# EAGLE design SparkFun_Transparent_Graphical_OLED_Breakout (EAGLE 9.1.3)
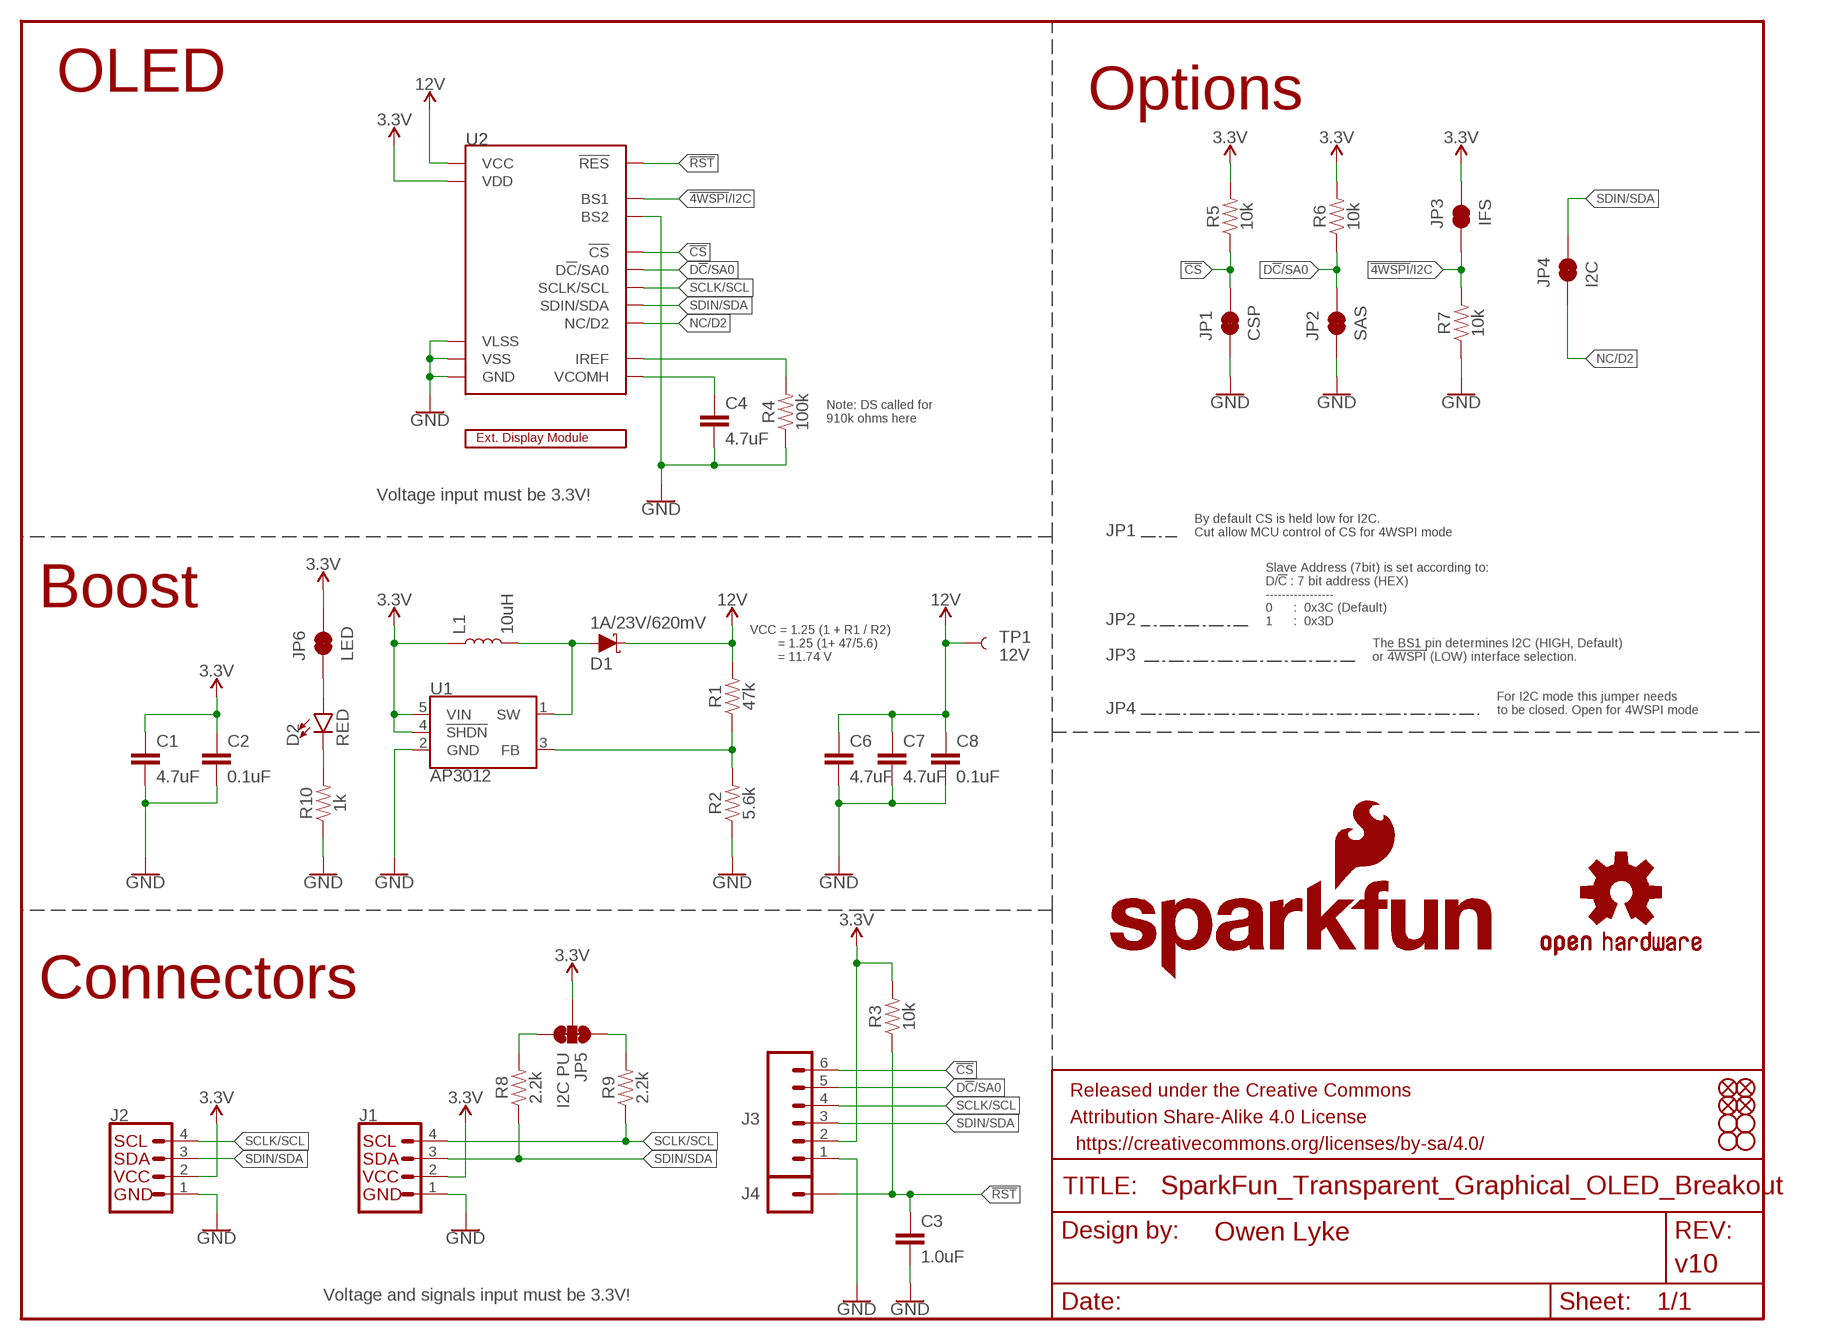
[diagram p0: schematic, sheet 1]

## Parts
C1  4.7uF  4.7UF-0603-35V-(20%)  [0603]
C2  0.1uF  0.1UF-0603-100V-10%  [0603]
C3  1.0uF  1.0UF-0603-16V-10%-X7R  [0603]
C4  4.7uF  4.7UF-0603-35V-(20%)  [0603]
C6  4.7uF  4.7UF-0603-35V-(20%)  [0603]
C7  4.7uF  4.7UF-0603-35V-(20%)  [0603]
C8  0.1uF  0.1UF-0603-100V-10%  [0603]
D1  1A/23V/620mV  DIODE-SCHOTTKY-BAT20J  [SOD-323]
D2  RED  LED-RED0603  [LED-0603]
FD1  FIDUCIAL1X2  [FIDUCIAL-1X2]
FD2  FIDUCIAL1X2  [FIDUCIAL-1X2]
FD3  FIDUCIAL1X2  [FIDUCIAL-1X2]
FD4  FIDUCIAL1X2  [FIDUCIAL-1X2]
FRAME1  FRAME-LETTER  [CREATIVE_COMMONS]
H1  STAND-OFF  [STAND-OFF]
H2  STAND-OFF  [STAND-OFF]
H3  STAND-OFF  [STAND-OFF]
H4  STAND-OFF  [STAND-OFF]
J1  QWIIC_CONNECTORJS-1MM  [JST04_1MM_RA]
J2  QWIIC_CONNECTORJS-1MM  [JST04_1MM_RA]
J3  CONN_06NO_SILK_NO_POP  [1X06_NO_SILK]
J4  CONN_01PTH_NO_SILK_YES_STOP  [1X01_NO_SILK]
JP1  CSP  JUMPER-SMT_2_NC_TRACE_SILK  [SMT-JUMPER_2_NC_TRACE_SILK]
JP2  SAS  JUMPER-SMT_2_NC_TRACE_SILK  [SMT-JUMPER_2_NC_TRACE_SILK]
JP3  IFS  JUMPER-SMT_2_NC_TRACE_SILK  [SMT-JUMPER_2_NC_TRACE_SILK]
JP4  I2C  JUMPER-SMT_2_NC_TRACE_SILK  [SMT-JUMPER_2_NC_TRACE_SILK]
JP5  I2C PU  JUMPER-SMT_3_2-NC_TRACE_SILK  [SMT-JUMPER_3_2-NC_TRACE_SILK]
JP6  LED  JUMPER-SMT_2_NC_TRACE_SILK  [SMT-JUMPER_2_NC_TRACE_SILK]
L1  10uH  INDUCTOR-CDRH-10UH  [INDUCTOR_4.7UH]
LOGO1  SFE_LOGO_NAME_FLAME.1_INCH  [SFE_LOGO_NAME_FLAME_.1]
LOGO2  OSHW-LOGOS  [OSHW-LOGO-S]
R1  47k  47KOHM-0603-1/10W-1%  [0603]
R2  5.6k  5.6KOHM-0603-1/10W-1%  [0603]
R3  10k  10KOHM-0603-1/10W-1%  [0603]
R4  100k  100KOHM-0603-1/10W-1%  [0603]
R5  10k  10KOHM-0603-1/10W-1%  [0603]
R6  10k  10KOHM-0603-1/10W-1%  [0603]
R7  10k  10KOHM-0603-1/10W-1%  [0603]
R8  2.2k  2.2KOHM-0603-1/10W-1%  [0603]
R9  2.2k  2.2KOHM-0603-1/10W-1%  [0603]
R10  1k  1KOHM-0603-1/10W-1%  [0603]
TP1  12V  TEST-POINT3  [PAD.03X.03]
U1  AP3012  [SOT23-5]
U2  UG-2856KLBAG01_4WSPI  [FPC05024-42201]
U$26  EXTERNAL_DISP-UG-2856KLBAG01  [EXT_DISP]

## Nets
3.3V: C1.1 C2.1 J1.2 J2.2 J3.2 JP3.1 JP5.2 JP6.2 L1.P$1 R3.2 R5.2 R6.2 U1.4(!SHDN!) U1.5(VIN) U2.P$5(VDD)
12V: C6.1 C7.1 C8.1 D1.C R1.2 TP1.P$1 U2.P$23(VCC)
!4WSPI!/I2C: JP3.2 R7.2 U2.P$6(BS1)
!CS: J3.6 JP1.2 R5.1 U2.P$8(!CS)
!RST: C3.1 J4.1 R3.1 U2.P$9(!RES)
D!C!/SA0: J3.5 JP2.2 R6.1 U2.P$10(D!C!/SA0)
GND: C1.2 C2.2 C3.2 C4.2 C6.2 C7.2 C8.2 J1.1 J2.1 J3.1 JP1.1 JP2.1 R2.1 R4.1 R7.1 R10.1 U1.2(GND) U2.P$1(GND) U2.P$2(VLSS) U2.P$3(VSS) U2.P$7(BS2) U2.P$11(GND) U2.P$12(GND) U2.P$16(GND) U2.P$17(GND) U2.P$18(GND) U2.P$19(GND) U2.P$20(GND) U2.P$24(GND)
N$1: R4.2 U2.P$21(IREF)
N$2: D2.C R10.2
N$3: C4.1 U2.P$22(VCOMH)
N$4: D1.A L1.P$2 U1.1(SW)
N$5: R1.1 R2.2 U1.3(FB)
N$6: JP5.3 R8.2
N$7: JP5.1 R9.2
N$8: D2.A JP6.1
NC/D2: JP4.1 U2.P$15(NC/D2)
SCLK/SCL: J1.4 J2.4 J3.4 R9.1 U2.P$13(SCLK/SCL)
SDIN/SDA: J1.3 J2.3 J3.3 JP4.2 R8.1 U2.P$14(SDIN/SDA)

## Notes on the sheet
- OLED | Options
- Note: DS called for
  910k ohms here
- Voltage input must be 3.3V!
- JP1
- By default CS is held low for I2C. 
  Cut allow MCU control of CS for 4WSPI mode
- Boost
- JP2
- Slave Address (7bit) is set according to:
  D/!C! : 7 bit address (HEX)
  -----------------
  0      :  0x3C (Default)
  1      :  0x3D
- VCC = 1.25 (1 + R1 / R2)
          = 1.25 (1+ 47/5.6)
          = 11.74 V
- JP3
- The BS1 pin determines I2C (HIGH, Default) 
  or !4WSPI! (LOW) interface selection.
- JP4
- For I2C mode this jumper needs 
  to be closed. Open for 4WSPI mode
- Connectors
- Voltage and signals input must be 3.3V!

## Library data of the parts
C1 C4 C6 C7 = SparkFun-Capacitors:4.7UF: 4.7µF ceramic capacitors A capacitor is a passive two-terminal electrical component used to store electrical energy temporarily in an electric field.; PROD_ID: CAP-14106
C2 C8 = SparkFun-Capacitors:0.1UF: 0.1µF ceramic capacitors A capacitor is a passive two-terminal electrical component used to store electrical energy temporarily in an electric field.; PROD_ID: CAP-08390
C3 = SparkFun-Capacitors:1.0UF: 1µF ceramic capacitors A capacitor is a passive two-terminal electrical component used to store electrical energy temporarily in an electric field.; PROD_ID: CAP-13930
D1 = SparkFun-DiscreteSemi:DIODE-SCHOTTKY: Schottky diode A Schottky diode is a semiconductor diode which has a low forward voltage drop and a very fast switching action.; PROD_ID: DIO-11623
D2 = SparkFun-LED:LED-RED: Red SMD LED Used in manufacturing of most products at SparkFun Packages: 0603 - SMD 0603 package [Product Link] <http://docs.avagotech.com/docs/AV02-0551EN> 0603 SMART - SMD 0603 SMART package ( more efficient and expensive)[Product Link] <http://www.osram-os.com/Graphics/XPic2/00077099_0.pdf> 1206 - SMD1206 package [Product Link] <https://www.sparkfun.com/datasheets/DevTools/LilyPad/Q150OVS4.pdff> SparkFun Products: Pro Mini 328 -5V <https://www.sparkfun.com/products/821> RedBoard <https://www.sparkfun.com/products/12757> IOIO-OTG <https://www.sparkfun.com/products/13613>; PROD_ID: DIO-00819
FD1-FD4 = SparkFun-Aesthetics:FIDUCIAL: Fiducial Alignment Points Point-of-reference for pick-and-place machines and other optical instruments.
FRAME1 = SparkFun-Aesthetics:FRAME-LETTER: Schematic Frame - Letter Standard 8.5x11 US Letter frame; DESIGNER: Owen Lyke; REV: v10
H1-H4 = SparkFun-Hardware:STAND-OFF: Stand Off Drill holes for mechanically mounting via screws, standoffs, etc. Note: Use the keepout ring to avoid running the screw head into surrounding components. Variant Overviews STAND-OFF - Mechanical footprint for a #4 phillips button head screw. STAND-OFF-TIGHT - Mechanical footprint for a #4 phillips button head screw, Example SparkFun Products Screw - Phillips Head (1/4", 4-40, 10 pack) <https://www.sparkfun.com/products/10453> (PRT-10453) Screw - Phillips Head (1/2", 4-40, 10 pack) <https://www.sparkfun.com/products/10452> (PRT-10452) Screw - Phillips Head (3/4", 4-40, 10 pack) <https://www.sparkfun.com/products/10451> (PRT-10451) Screw - Phillips Head (1", 4-40, 10 pack) <https://www.sparkfun.com/products/10450> (PRT-10450)
J1 J2 = SparkFun-Connectors:QWIIC_CONNECTOR: SparkFun I2C Standard Qwiic Connector An SMD 1mm pitch JST connector makes it easy and quick (get it? Qwiic?) to connect I2C devices to each other. The Qwiic system <http://www.sparkfun.com/qwiic> enables fast and solderless connection between popular platforms and various sensors and actuators. We carry 200mm <https://www.sparkfun.com/products/14204>, 100mm <https://www.sparkfun.com/products/14205>, 50mm <https://www.sparkfun.com/products/14206>, and breadboard friendly <https://www.sparkfun.com/products/14207> Qwiic cables. We also offer 10 pcs strips <https://www.sparkfun.com/products/14323> the SMD connectors.; PROD_ID: CONN-13694
J3 = SparkFun-Connectors:CONN_06: Multi connection point. Often used as Generic Header-pin footprint for 0.1 inch spaced/style header connections On any of the 0.1 inch spaced packages, you can populate with these: Break Away Headers - Straight <https://www.sparkfun.com/products/116> (PRT-00116) Break Away Male Headers - Right Angle <https://www.sparkfun.com/products/553> (PRT-00553) Female Headers <https://www.sparkfun.com/products/115> (PRT-00115) Break Away Headers - Machine Pin <https://www.sparkfun.com/products/117> (PRT-00117) Break Away Female Headers - Swiss Machine Pin <https://www.sparkfun.com/products/743> (PRT-00743) Arduino Stackable Header - 6 Pin <https://www.sparkfun.com/products/9280> (PRT-09280) For SCREWTERMINALS and SPRING TERMINALS visit here: Screw Terimnals on SparkFun.com <https://www.sparkfun.com/search/results?term=Screw+Terminals> (5mm/3.5mm/2.54mm spacing) This device is also useful as a general connection point to wire up your design to another part of your project. Our various solder wires solder well into these plated through hole pads. Hook-Up Wire - Assortment (Stranded, 22 AWG) <https://www.sparkfun.com/products/11375> (PRT-11375) Hook-Up Wire - Assortment (Solid Core, 22 AWG) <https://www.sparkfun.com/products/11367> (PRT-11367) View the entire wire category on our website here <https://www.sparkfun.com/categories/141>
J4 = SparkFun-Connectors:CONN_01: Single connection point. Often used as Generic Header-pin footprint for 0.1 inch spaced/style header connections On any of the 0.1 inch spaced packages, you can populate with these: Break Away Headers - Straight <https://www.sparkfun.com/products/116> (PRT-00116) Break Away Male Headers - Right Angle <https://www.sparkfun.com/products/553> (PRT-00553) Female Headers <https://www.sparkfun.com/products/115> (PRT-00115) Break Away Headers - Machine Pin <https://www.sparkfun.com/products/117> (PRT-00117) Break Away Female Headers - Swiss Machine Pin <https://www.sparkfun.com/products/743> (PRT-00743) This device is also useful as a general connection point to wire up your design to another part of your project. Our various solder wires solder well into these plated through hole pads. Hook-Up Wire - Assortment (Stranded, 22 AWG) <https://www.sparkfun.com/products/11375> (PRT-11375) Hook-Up Wire - Assortment (Solid Core, 22 AWG) <https://www.sparkfun.com/products/11367> (PRT-11367) View the entire wire category on our website here <https://www.sparkfun.com/categories/141> Special notes: SMTSO-256-ET is a "flush mount" nut for a 4-40 screw. We mostly use this on specialty testbeds; it is a nice way to connect hardware to your PCB at an adjustable hieght. Also note, the SNAP packages are for using a snappable style connector. We sell a baggie of snaps and they are also used on two LilyPad designs: Snap Assortment - 30 pack (male and female) <https://www.sparkfun.com/products/11347> (DEV-11347) LilyPad Arduino SimpleSnap <https://www.sparkfun.com/products/10941> (DEV-10941) LilyPad SimpleSnap Protoboard <https://www.sparkfun.com/products/10940> (DEV-10940)
JP1-JP4 JP6 = SparkFun-Jumpers:JUMPER-SMT_2_NC_TRACE: Normally closed trace jumper This jumper has a trace between two pads so it's normally closed (NC). Use a razor knife to open the connection. For best results follow the IPC guidelines for cutting traces: Cutout at least 0.063 mm (0.005 in). Remove all loose material to clean up the cut area. Seal the cut with an approved epoxy. Reapply solder to reclose the connection.
JP5 = SparkFun-Jumpers:JUMPER-SMT_3_2-NC_TRACE: Normally closed trace jumper (2 of 2 connections) This jumper has a trace between all three pads so they are normally closed (NC). Use a razor knife to open the connection(s). For best results follow the IPC guidelines for cutting traces: Cutout at least 0.063 mm (0.005 in). Remove all loose material to clean up the cut area. Seal the cut with an approved epoxy. Reapply solder to reclose the connection(s).
L1 = SparkFun-Coils:INDUCTOR: Inductors Resist changes in electrical current. Basically a coil of wire. SparkFun Products: SparkFun Load Cell Amplifier - HX711 <https://www.sparkfun.com/products/13879> IOIO-OTG - V2.2 <https://www.sparkfun.com/products/13613>; PROD_ID: NDUC-13968
LOGO1 = SparkFun-Aesthetics:SFE_LOGO_NAME_FLAME: SparkFun Font Logo w/ Flame This is the SparkFun full logo. The logo on the schematic will always be the same size; the package variant is the height of the flame part of the logo. Default layer for the logo on the board is tSilk.
LOGO2 = SparkFun-Aesthetics:OSHW-LOGO: Open-Source Hardware (OSHW) Logo This logo indicates the piece of hardware it is found on incorporates a OSHW license and/or adheres to the definition of open source hardware found here: http://freedomdefined.org/OSHW
R1 = SparkFun-Resistors:47KOHM: 47kΩ resistor A resistor is a passive two-terminal electrical component that implements electrical resistance as a circuit element. Resistors act to reduce current flow, and, at the same time, act to lower voltage levels within circuits. - Wikipedia; PROD_ID: RES-07871
R2 = SparkFun-Resistors:5.6KOHM: 5.6kΩ resistor A resistor is a passive two-terminal electrical component that implements electrical resistance as a circuit element. Resistors act to reduce current flow, and, at the same time, act to lower voltage levels within circuits. - Wikipedia; PROD_ID: RES-12378
R3 R5-R7 = SparkFun-Resistors:10KOHM: 10kΩ resistor A resistor is a passive two-terminal electrical component that implements electrical resistance as a circuit element. Resistors act to reduce current flow, and, at the same time, act to lower voltage levels within circuits. - Wikipedia; PROD_ID: RES-00824
R4 = SparkFun-Resistors:100KOHM: 100kΩ resistor A resistor is a passive two-terminal electrical component that implements electrical resistance as a circuit element. Resistors act to reduce current flow, and, at the same time, act to lower voltage levels within circuits. - Wikipedia; PROD_ID: RES-07828
R8 R9 = SparkFun-Resistors:2.2KOHM: 2.2kΩ resistor A resistor is a passive two-terminal electrical component that implements electrical resistance as a circuit element. Resistors act to reduce current flow, and, at the same time, act to lower voltage levels within circuits. - Wikipedia; PROD_ID: RES-08272
R10 = SparkFun-Resistors:1KOHM: 1kΩ resistor A resistor is a passive two-terminal electrical component that implements electrical resistance as a circuit element. Resistors act to reduce current flow, and, at the same time, act to lower voltage levels within circuits. - Wikipedia; PROD_ID: RES-07856
TP1 = SparkFun-Connectors:TEST-POINT: SparkFun Test Points Bare copper test points for troubleshooting or In-Circuit-Testing. These are used by our Production team for verifying production board runs using pogo-pins on test beds. SparkFun Products: SparkFun LSM9DS1 Breakout <https://www.sparkfun.com/products/13284> SparkFun PSOC <https://www.sparkfun.com/products/13714> SparkFun Load Cell Amplifier <https://www.sparkfun.com/products/13879>
U1 = SparkFun-IC-Power:AP3012: AP3012 The AP3012 is a high power, constant frequency, current mode PWM, inductor based, step-up (boost) converter. The converter operates at high frequency (1.5MHz) so that a small, low profile inductor can be used. Datasheet <https://www.diodes.com/assets/Datasheets/AP3012.pdf>; PROD_ID: VREG-13911
U2 = SparkFun-Displays:UG-2856KLBAG01_4WSPI; PROD_ID: CONN-14195
U$26 = SparkFun-Displays:EXTERNAL_DISP: External Display Device Use this device to represent a display module that you connect to your board with a connector. (The connector will be electrically linked to the symbol for your display and connected to traces) Using this along with a footprint of the display module outline will allow the BOM utility to find the correct PROD_ID for the module. Then you can move it to the BOM list (it will be in non-BOM list unless it has a hardware element like holes or pads) Variants: KWH018ST14-F01A footprint of the KWH018ST14-F01 with holes SparkFun Products:; PROD_ID: LCD-14194

## Board
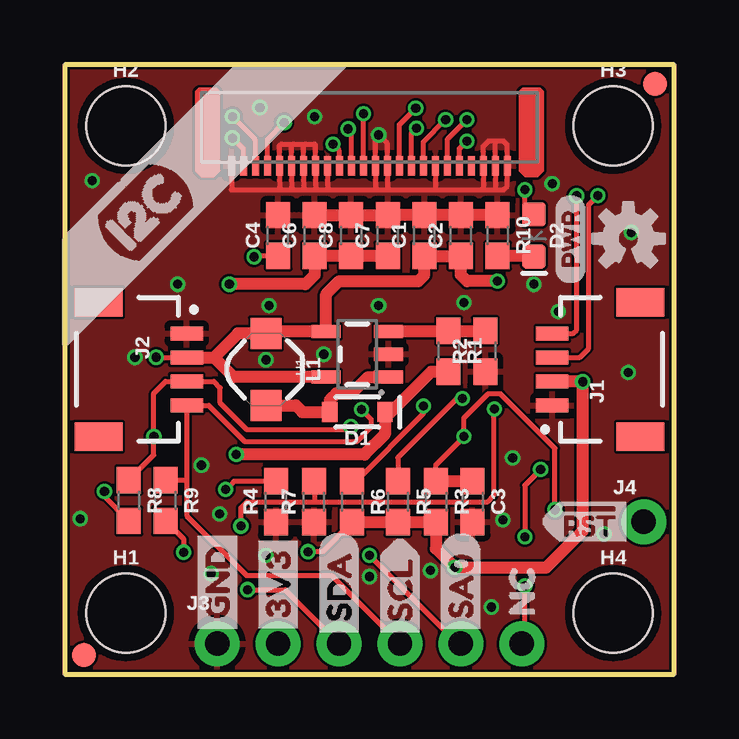
[diagram p1: board, top side]
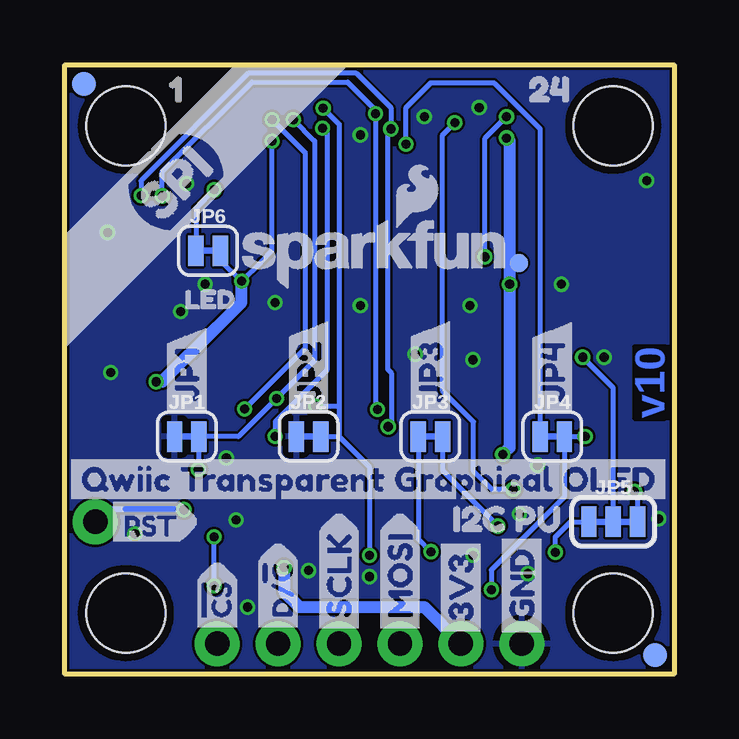
[diagram p2: board, bottom side, seen from below]

Size 25.4 x 25.4 mm. Coordinates in mm from the lower left corner, seen from the top.
Outline: 0,0 25.4,0 25.4,25.4 0,25.4 0,0
Copper layers (1*16): Top 0.035mm / dielectric 1.5mm / Bottom 0.035mm
Design rules "SparkFun-2-layer-FAB-LIMIT": minimum track width 4mil, minimum drill 6mil, track to track 4mil, track to pad 4mil, pad to pad 4mil, via to via 4mil, smd to smd 4mil, copper to edge 4mil, drill to drill 4mil, minimum pad ring 5mil, minimum via ring 5mil, stop-mask expansion 4mil, vias tented up to drill 25mil, thermal gap 10mil

### Footprints (pad centres in the part's own frame; a part is rotated, then mirrored left to right if it is on the bottom)
0603 = smd 1.1 x 1: 1 -0.85,0; 2 0.85,0
SOD-323 = smd 0.63 x 0.83: A 1.15,0; C -1.15,0
LED-0603 = smd 1 x 1: A -0.877,0; C 0.877,0
FIDUCIAL-1X2 = smd 1 x 1: 1 0,0
STAND-OFF = hole 3.302: 0,0
JST04_1MM_RA = smd 0.6 x 1.35: 1 -1.5,0; 2 -0.5,0; 3 0.5,0; 4 1.5,0 | smd 1.2 x 2: NC1 2.8,-3.675; NC2 -2.8,-3.675
1X06_NO_SILK = drill 1.016 pad 1.88: 1 0,0; 2 2.54,0; 3 5.08,0; 4 7.62,0; 5 10.16,0; 6 12.7,0
1X01_NO_SILK = drill 1.016 pad 1.88: 1 0,0
SMT-JUMPER_2_NC_TRACE_SILK = smd 0.635 x 1.27: 1 -0.508,0; 2 0.508,0
SMT-JUMPER_3_2-NC_TRACE_SILK = smd 0.635 x 1.27: 1 -1.016,0; 2 0,0; 3 1.016,0
INDUCTOR_4.7UH = smd 1.3 x 1.3: P$1 -1.5,0; P$2 1.5,0
PAD.03X.03 = smd 0.762 x 0.762: P$1 0,0
SOT23-5 = smd 0.55 x 1.2: 1 -0.95,-1.3; 2 0,-1.3; 3 0.95,-1.3; 4 0.95,1.3; 5 -0.95,1.3
FPC05024-42201 = smd 0.3 x 0.8: P$1 -5.75,0.4; P$2 -5.25,0.4; P$3 -4.75,0.4; P$4 -4.25,0.4; P$5 -3.75,0.4; P$6 -3.25,0.4; P$7 -2.75,0.4; P$8 -2.25,0.4; P$9 -1.75,0.4; P$10 -1.25,0.4; P$11 -0.75,0.4; P$12 -0.25,0.4; P$13 0.25,0.4; P$14 0.75,0.4; P$15 1.25,0.4; P$16 1.75,0.4; P$17 2.25,0.4; P$18 2.75,0.4; P$19 3.25,0.4; P$20 3.75,0.4; P$21 4.25,0.4; P$22 4.75,0.4; P$23 5.25,0.4; P$24 5.75,0.4

### Placement (x,y rotation side)
C1  14.99,18.29 90 top
C2  16.51,18.29 90 top
C3  16.99,7.19 270 top
C4  8.89,18.29 90 top
C6  10.41,18.29 90 top
C7  13.46,18.29 90 top
C8  11.94,18.29 90 top
D1  12.19,10.92 180 top
D2  19.56,18.29 270 top
FD1  0.79,0.79 0 top
FD2  0.79,0.79 0 bottom
FD3  24.61,24.61 0 top
FD4  24.61,24.61 0 bottom
FRAME1  -11.43,-10.16 0 top  (outside the outline)
H1  2.54,2.54 0 top
H2  2.54,22.86 0 top
H3  22.86,22.86 0 top
H4  22.86,2.54 0 top
J1  20.32,12.7 90 top
J2  5.08,12.7 270 top
J3  6.35,1.27 0 top
J4  24.13,6.35 0 top
JP1  20.32,9.91 0 bottom
JP2  15.24,9.91 0 bottom
JP3  10.16,9.91 0 bottom
JP4  5.08,9.91 0 bottom
JP5  2.54,6.35 0 bottom
JP6  19.43,17.65 0 bottom
L1  8.38,12.7 270 top
LOGO1  12.45,17.53 0 bottom
LOGO2  23.5,18.16 0 top
R1  16,13.46 270 top
R2  17.53,13.46 90 top
R3  15.47,7.19 270 top
R4  8.8,7.19 90 top
R5  13.88,7.19 270 top
R6  11.98,7.19 270 top
R7  10.39,7.19 90 top
R8  2.67,7.24 270 top
R9  4.19,7.24 270 top
R10  18.03,18.29 270 top
TP1  6.48,17.14 0 bottom
U1  12.19,13.34 90 top
U2  12.7,21.59 180 top
U$1  [JP10]  20.32,10.41 90 bottom
U$2  [QWIIC_TRANSPARENT_GRAPHICAL_OLED15]  25.65,8.13 0 bottom
U$3  [JP21]  15.24,10.41 90 bottom
U$4  [GND0]  6.35,1.4 90 top
U$5  [3V31]  8.89,1.4 90 top
U$6  [SCL0]  13.97,1.27 90 top
U$7  [SDA3]  11.43,1.27 90 top
U$8  [#CS7]  19.05,1.27 90 bottom
U$9  [NC10]  19.05,1.52 90 top
U$10  [MOSI9]  11.43,1.4 90 bottom
U$11  [JP32]  10.16,10.41 90 bottom
U$12  [SA08]  16.51,1.4 90 top
U$13  [3V31]  8.89,1.27 90 bottom
U$14  [GND0]  6.35,1.27 90 bottom
U$15  [D##C6]  16.51,1.27 90 bottom
U$16  [JP43]  5.08,10.41 90 bottom
U$17  [#RST1]  24.03,6.35 0 bottom
U$18  [LED4]  21.08,15.62 0 bottom
U$19  [I2C3]  1.14,17.14 45 top
U$20  [SCLK2]  13.97,1.4 90 bottom
U$21  [PWR5]  21.08,16.26 90 top
U$22  [17]  21.97,24.38 0 bottom
U$23  [248]  6.99,24.38 0 bottom
U$24  [SPI2]  22.86,18.41 45 bottom
U$25  [I2C_PU0]  10.16,6.48 0 bottom
U$26  -19.05,-15.24 0 top  (outside the outline)
U$28  [#RST0]  19.68,6.35 0 top

### Tracks (layer width: path | path; a pad name or v marks a point on that pad's centre or on a via)
3.3V  (via drill 0.38)
  Top 0.203: U2.P$5 16.45,21.91 v16.76,22.23 | R6.2 10.74,5.1 v10.14,5.1 | v3.81,13.21 v3.82,13.2 J2.2
  Top 0.508: J2.2 6.21,13.2 | 6.21,13.2 7.21,14.2 L1.P$1 8.47,14.29 U1.4 10.89,15.85 11.43,16.38 14.73,16.38 14.99,16.64 C1.1 C2.1 16.51,16.64 16.76,16.38 v18.03,16.38 | J1.2 v21.58,12.2 v21.59,12.19 21.59,5.97 20.83,5.21 20.07,4.45 v16.26,4.45 15.47,5.23 R3.2 R5.2 R6.2 | U1.5 7.03,12.38 6.21,13.2
  Bottom 0.203: v16.76,22.23 16.76,17.65 17.21,17.21 v18.03,16.38 18.92,17.27 JP6.2 | JP3.1 10.67,5.63 v10.14,5.1 | JP5.2 2.54,11.94 v3.81,13.21
  Bottom 0.508: v16.26,4.45 16.26,3.43 15.62,2.79 10.41,2.79 J3.2 | v18.03,16.38 18.03,15.49 19.05,14.48 21.34,12.19 v21.59,12.19
12V  (via drill 0.38)
  Top 0.203: U2.P$23 7.45,21.89 v6.99,22.35
  Top 0.508: C7.1 C8.1 C6.1 10.41,16.64 10.03,16.26 v6.86,16.26 | R1.2 15.28,12.61 13.59,10.92 D1.C 13.34,10 12.5,9.16 v7.14,9.16
  Bottom 0.203: TP1.P$1 6.86,17.14
  Bottom 0.508: v6.99,22.35 6.86,22.23 6.86,17.14 v6.86,16.26 6.86,9.44 v7.14,9.16
!4WSPI!/I2C  (via drill 0.38)
  Top 0.203: U2.P$6 15.95,22.3 v16.76,23.11 | v7.34,6.17 7.34,6.93 7.59,7.19 10.41,7.19 | 10.41,7.19 17.63,7.19 17.88,7.44 17.88,11.02 v17.91,11.05 | R7.2 10.41,8.01 10.41,7.19
  Bottom 0.203: v16.76,23.11 15.37,21.72 15.37,13.59 v17.91,11.05 | JP3.2 9.65,8.48 v7.34,6.17
!CS  (via drill 0.38)
  Top 0.203: U2.P$8 14.95,22.19 v15.88,23.11 | v19.84,8.53 19.18,7.87 v19.18,5.71 | J3.6 19.18,1.4 v19.18,3.68 | R5.1 13.88,9.03 16.34,11.49 v16.57,11.49
  Bottom 0.203: v15.88,23.11 14.99,22.23 14.99,13.08 v16.57,11.49 18.16,9.91 JP1.2 19.81,8.56 v19.84,8.53 | v19.18,3.68 v19.18,5.71
!RST  (via drill 0.38)
  Top 0.203: U2.P$9 14.45,22.55 v14.66,22.76 | v20.43,6.86 20.43,9.41 18.16,11.68 17.64,11.68 16.63,10.67 v16.63,9.91 16.63,9.88 15.47,8.72 R3.1
  Top 0.508: C3.1 R3.1
  Bottom 0.203: v14.66,22.76 14.48,22.58 14.48,12.68 16.63,10.52 v16.63,9.91
  Bottom 0.254: v20.43,6.86 23.62,6.86 J4.1
D!C!/SA0  (via drill 0.38)
  Top 0.203: U2.P$10 13.95,22.92 v14.63,23.6 | R6.1 12.13,8.04 14.95,10.86 v14.95,11.18 | v12.7,4.95 16.38,1.27 J3.5
  Bottom 0.203: v14.63,23.6 13.97,22.94 13.97,11.18 | 13.97,11.18 13.97,9.91 | v14.95,11.18 13.97,11.18 | JP2.2 13.97,9.91 | 13.97,9.91 12.7,8.64 v12.7,4.95
GND  (via drill 0.38)
  Top 0.203: U2.P$24 6.95,20.19 8.89,20.19 | 8.89,20.19 9.53,20.19 | 9.53,20.19 9.91,20.19 | 9.91,20.19 10.41,20.19 | 10.41,20.19 10.92,20.19 | 10.92,20.19 12.95,20.19 | 12.95,20.19 13.46,20.19 | 13.46,20.19 15.49,20.19 | 15.49,20.19 17.53,20.19 | 17.53,20.19 17.91,20.19 | 17.91,20.19 18.29,20.19 18.45,20.36 U2.P$1 18.45,22.06 18.29,22.23 17.91,22.23 | 17.91,20.19 17.95,20.24 U2.P$2 17.95,22.18 17.91,22.23 | 17.53,20.19 17.45,20.27 U2.P$3 17.45,22.02 17.65,22.23 17.91,22.23 | U2.P$7 15.45,20.24 15.49,20.19 | 13.46,20.19 13.45,20.2 U2.P$11 13.45,22.11 v13.08,22.48 12.95,22.35 U2.P$12 12.95,20.2 12.95,20.19 | U2.P$16 10.95,20.22 10.92,20.19 | 10.41,20.19 10.45,20.23 U2.P$17 10.45,22.06 10.41,22.1 10.03,22.1 | 9.91,20.19 9.95,20.24 U2.P$18 9.95,22.02 10.03,22.1 | 9.53,20.19 9.45,20.27 U2.P$19 9.45,22.02 9.53,22.1 | 8.89,20.19 8.95,20.25 U2.P$20 8.95,22.03 9.02,22.1 9.53,22.1 | 9.53,22.1 10.03,22.1
  Top 0.508: C6.2 C8.2 C7.2 C1.2 C2.2 R10.1
  other vias: 10.79,13.34 15.24,4.32 8.38,13.11 8.51,15.37 8.38,4.95 5.69,8.71 17.78,2.79 1.14,20.57 4.7,16.26 22.48,5.84 19.56,16.26 20.32,20.45 20.57,15.11 16.64,15.49 10.41,23.24 8.13,23.62 23.62,18.41 23.5,12.57 13.08,15.37 6.45,6.68 18.26,6.43 12.7,4.06 18.67,9.02 6.1,4.19 0.64,6.48 2.92,13.21
  pour Top (isolate 0.051): 0,25.4 25.4,25.4 25.4,0 0,0
  pour Bottom (isolate 0.051): 0,25.4 25.4,25.4 25.4,0 0,0
N$1  (via drill 0.38)
  Top 0.203: U2.P$21 8.45,22.29 v9.14,22.99 | R4.2 7.05,8.04 v6.71,7.7
  Bottom 0.203: v9.14,22.99 9.65,22.48 9.65,11.81 8.36,10.52 8.36,8.46 7.59,7.7 v6.71,7.7
N$2
  Top 0.508: D2.C 19.53,17.44 R10.2
N$3  (via drill 0.38)
  Top 0.203: U2.P$22 7.95,22.28 v6.99,23.24 | C4.1 7.93,17.44 v7.89,17.4
  Bottom 0.203: v7.89,17.4 7.89,22.34 v6.99,23.24
N$4
  Top 0.508: U1.1 12.64,12.38 11.96,11.7 11.32,11.7 11.04,11.42 D1.A 9.91,10.92 9.63,11.2 L1.P$2
N$5
  Top 0.508: R2.2 R1.1 15.97,14.29 U1.3
N$6  (via drill 0.38)
  Top 0.203: R8.2 1.65,7.41 v1.65,7.62
  Bottom 0.203: JP5.3 1.52,7.49 v1.65,7.62
N$7  (via drill 0.38)
  Top 0.203: R9.2 4.95,5.63 v4.95,5.08
  Bottom 0.203: v4.95,5.08 4.95,5.71 4.32,6.35 JP5.1
N$8  (via drill 0.38)
  Top 0.203: D2.A 19.18,19.55 v19.18,20.19
  Bottom 0.203: v19.18,20.19 19.94,19.43 JP6.1
NC/D2  (via drill 0.38)
  Top 0.203: U2.P$15 11.45,21.82 v11.18,22.1
  Bottom 0.203: v11.18,22.1 11.18,23.62 10.16,24.64 7.49,24.64 5.59,22.73 JP4.1
SCLK/SCL  (via drill 0.38)
  Top 0.203: U2.P$13 v12.45,23.36 v12.45,23.37 | J1.4 21.18,14.2 21.34,14.35 v21.34,19.94 | v12.37,11.03 12.77,10.62 12.77,10.29 12.17,9.69 7.5,9.69 6,11.2 J2.4 5.08,8.09 | J3.4 11.12,4.12 7.57,4.12 5.08,6.6 5.08,8.09 | R9.1 5.08,8.09
  Bottom 0.203: v12.37,11.03 12.45,11.11 v12.45,23.37 12.45,23.52 13.61,24.69 17.6,24.69 21.34,20.95 v21.34,19.94
SDIN/SDA  (via drill 0.38)
  Top 0.203: U2.P$14 11.95,22.59 v11.81,22.73 | J1.3 21.46,13.2 21.84,13.58 21.84,19.57 v22.23,19.95 | v11.92,10.31 11.79,10.19 7.59,10.19 6.48,11.3 6.48,11.94 6.21,12.2 J2.3 4.2,12.2 3.71,11.71 v3.71,9.91 3.71,9.13 R8.1 | v7.62,3.52 9.18,3.52 J3.3
  Bottom 0.203: v22.23,19.95 22.23,20.57 17.75,25.04 13.23,25.04 11.81,23.62 v11.81,22.73 11.94,22.61 11.94,12.7 11.77,12.53 11.77,10.46 v11.92,10.31 | v7.62,3.52 7.62,4.34 4.57,7.39 JP4.2 v3.71,9.91

### Text on the board
Bottom: v10
tDocu: Owen Lyke